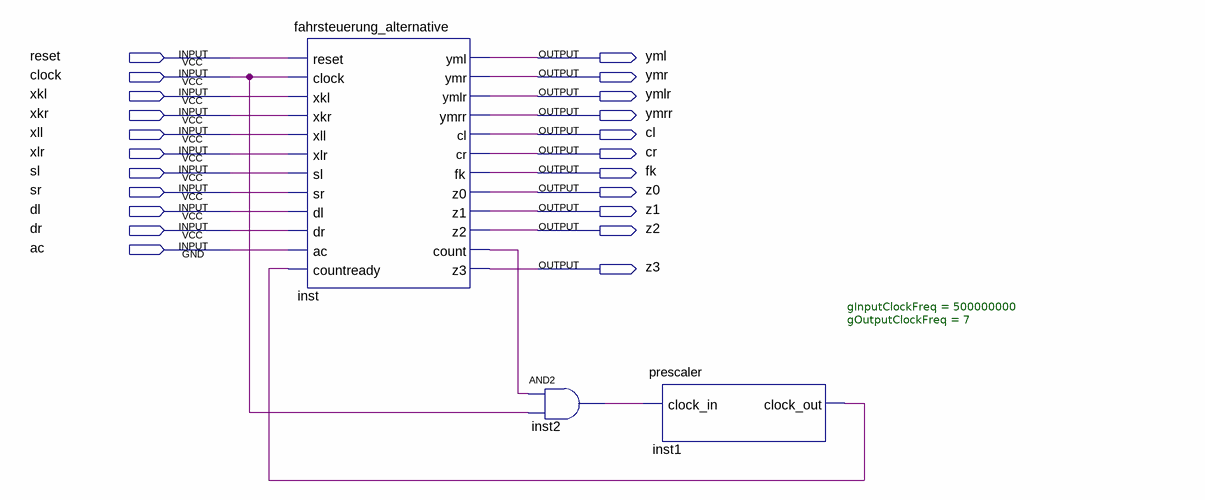
[diagram p0: schematic sheet]
// Quartus schematic fahrsteuerung_alternative_Block.bdf as structural Verilog: 3 symbols, 22 pins
module fahrsteuerung_alternative_Block (
  input  reset,
  input  clock,
  input  xkl,
  input  xkr,
  input  xll,
  input  xlr,
  input  sl,
  input  sr,
  input  dl,
  input  dr,
  input  ac,
  output yml,
  output ymr,
  output ymlr,
  output ymrr,
  output cl,
  output cr,
  output fk,
  output z0,
  output z1,
  output z2,
  output z3
);

  wire inst1_clock_out, inst2_out, inst_count;

  fahrsteuerung_alternative inst (
    .reset(reset), .clock(clock), .xkl(xkl), .xkr(xkr), .xll(xll), .xlr(xlr), .sl(sl), .sr(sr), .dl(dl),
    .dr(dr), .ac(ac), .countready(inst1_clock_out), .yml(yml), .ymr(ymr), .ymlr(ymlr), .ymrr(ymrr), .cl(cl),
    .cr(cr), .fk(fk), .z0(z0), .z1(z1), .z2(z2), .count(inst_count), .z3(z3));
  and inst2 (inst2_out, inst_count, clock);
  prescaler #(.gInputClockFreq(500000000), .gOutputClockFreq(7)) inst1 (
    .clock_in(inst2_out), .clock_out(inst1_clock_out));
endmodule
